# EAGLE design SparkFun_ACS712_Breakout (EAGLE 7.3.0)
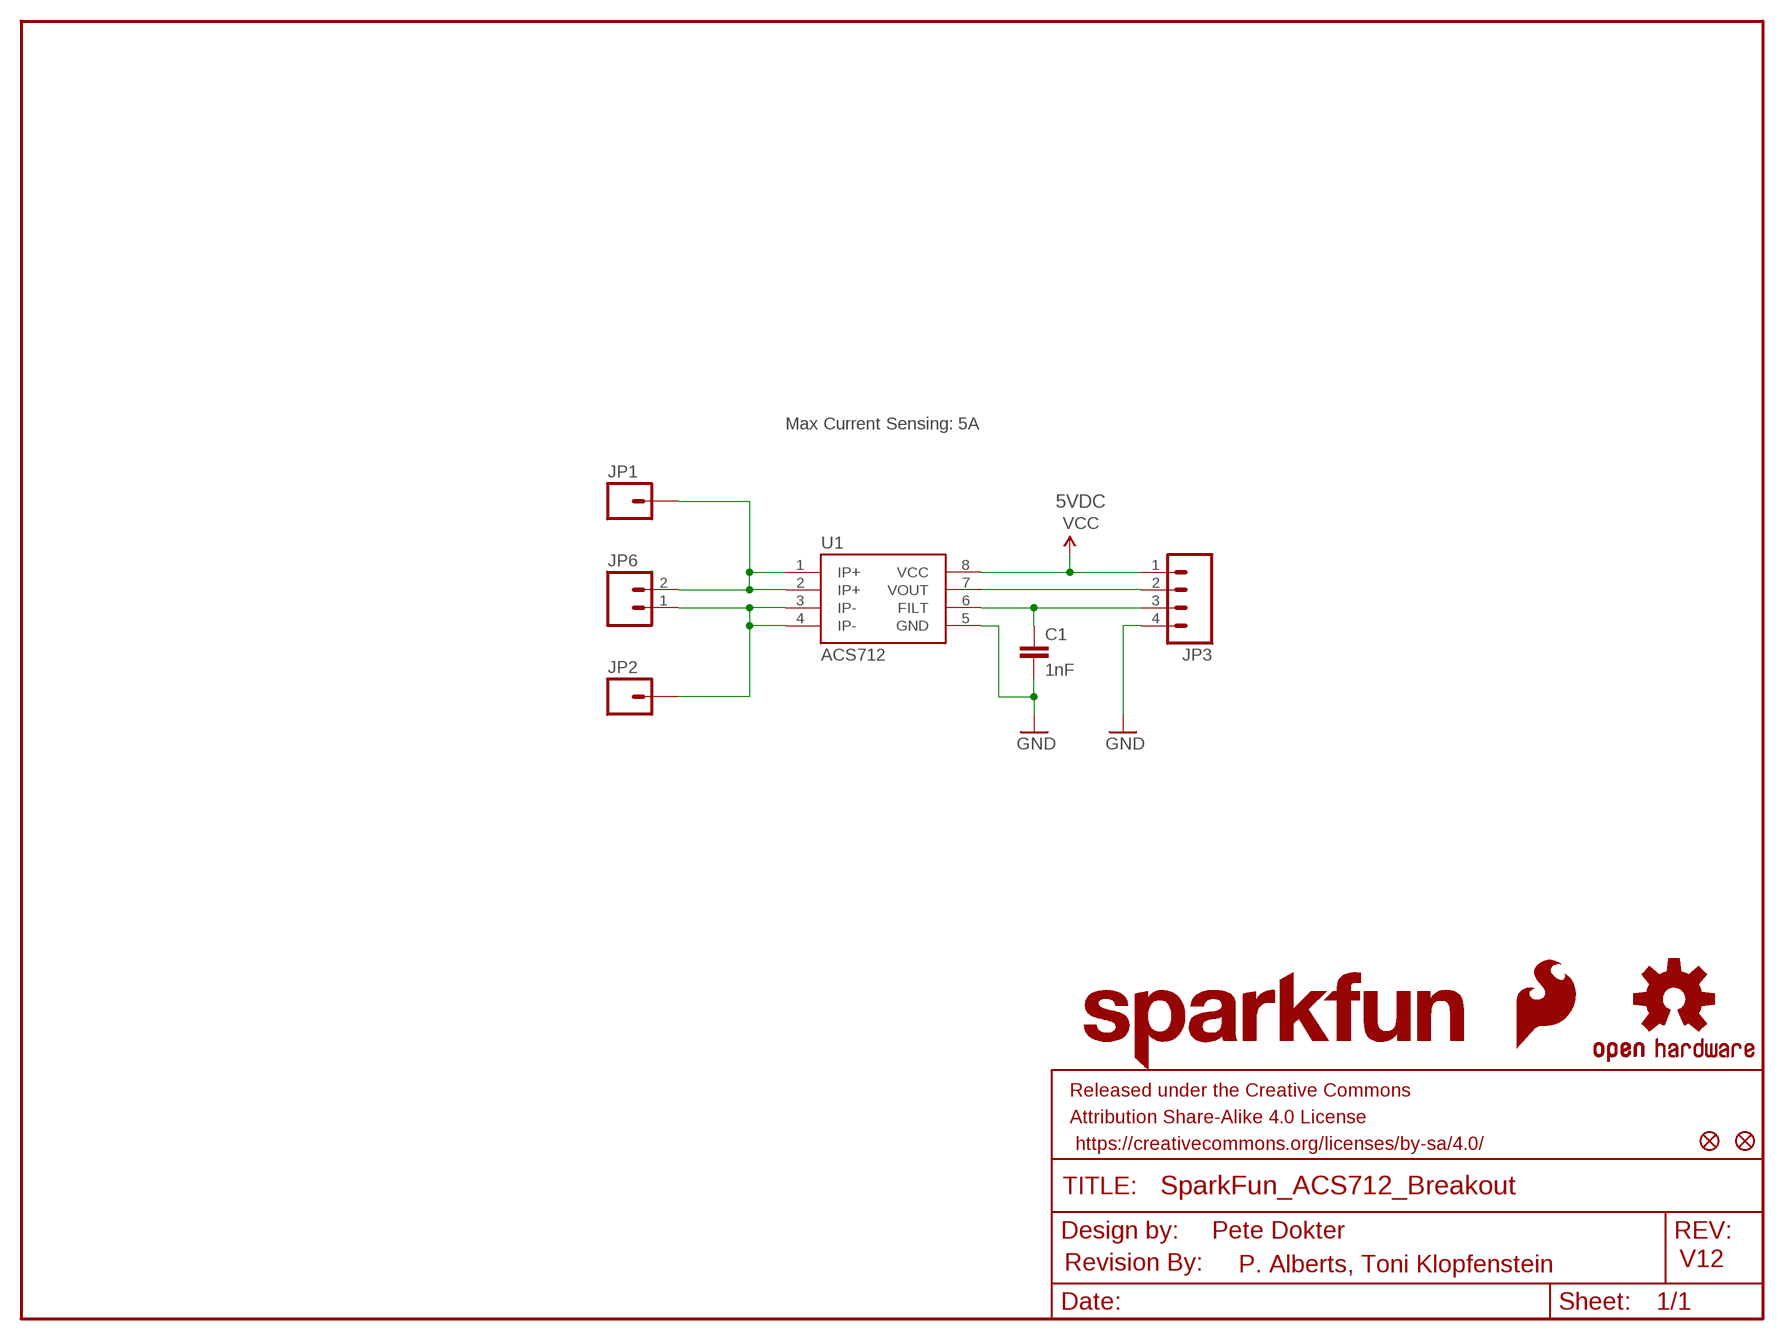
[diagram p0: schematic, sheet 1]

## Parts
C1  1nF  1NF/1000PF-50V-10%(0603)  [0603-CAP]
FRAME1  FRAME-LETTER  [CREATIVE_COMMONS]
JP1  M01-SMTSO-256-ET  [SMTSO-256-ET]
JP2  M01-SMTSO-256-ET  [SMTSO-256-ET]
JP3  M04PTH  [1X04]
JP4  FIDUCIALUFIDUCIAL  [MICRO-FIDUCIAL]
JP5  FIDUCIALUFIDUCIAL  [MICRO-FIDUCIAL]
JP6  M021X02_NO_SILK  [1X02_NO_SILK]
LOGO1  SFE_LOGO_NAME.1_INCH  [SFE_LOGO_NAME_.1]
LOGO2  SFE_LOGO_FLAME.3_INCH  [SFE_LOGO_FLAME_.3]
U1  ACS712  [SO08]
U$1  REVISION  [REVISION]
U$3  OSHW-LOGOS  [OSHW-LOGO-S]

## Nets
FILT: C1.1 JP3.3 U1.6(FILT)
GND: C1.2 JP3.4 U1.5(GND)
IP+: JP1.P$1 JP6.2 U1.1(IP+) U1.2(IP+)
IP-: JP2.P$1 JP6.1 U1.3(IP-) U1.4(IP-)
VCC: JP3.1 U1.8(VCC)
VOUT: JP3.2 U1.7(VOUT)

## Notes on the sheet
- Max Current Sensing: 5A
- 5VDC
- Pete Dokter
- P. Alberts, Toni Klopfenstein | V12

## Library data of the parts
C1 = SparkFun-Capacitors:1NF/1000PF-50V-10%(0603): CAP-07886; PROD_ID: CAP-07886
FRAME1 = SparkFun-Aesthetics:FRAME-LETTER: Schematic Frame Standard 8.5x11 US Letter frame; DESIGNER: NAME; VERSION: v01
JP1 JP2 = SparkFun-Connectors:M01: Header 1 Standard 1-pin 0.1" header. Use with straight break away headers (SKU : PRT-00116), right angle break away headers (PRT-00553), swiss pins (PRT-00743), machine pins (PRT-00117), and female headers (PRT-00115).
JP3 = SparkFun-Connectors:M04: Header 4 Standard 4-pin 0.1" header. Use with straight break away headers (SKU : PRT-00116), right angle break away headers (PRT-00553), swiss pins (PRT-00743), machine pins (PRT-00117), and female headers (PRT-00115). Molex polarized connector foot print use with SKU : PRT-08231 with associated crimp pins and housings. 1MM SMD Version SKU: PRT-10208
JP4 JP5 = SparkFun-Aesthetics:FIDUCIAL: Fiducial Alignment Points Various fiducial points for machine vision alignment.
JP6 = SparkFun-Connectors:M02: Standard 2-pin 0.1" header. Use with - straight break away headers ( PRT-00116) - right angle break away headers (PRT-00553) - swiss pins (PRT-00743) - machine pins (PRT-00117) - female headers (PRT-00115) Molex polarized connector foot print use with: PRT-08233 with associated crimp pins and housings. 2.54_SCREWTERM for use with PRT-10571. 3.5mm Screw Terminal footprints for PRT-08084 5mm Screw Terminal footprints for use with PRT-08432
LOGO1 = SparkFun-Aesthetics:SFE_LOGO_NAME: SFE Logo, name only This is the SparkFun name logo. The logo on the schematic will always be the same size; the package variant is the height of the flame part of the logo (or the height the flame would be, if it were drawn). Default layer for the logo on the board is tSilk.
LOGO2 = SparkFun-Aesthetics:SFE_LOGO_FLAME: SFE Logo, flame only This is the SparkFun flame logo. The logo on the schematic will always be the same size; the package variant is the height of the flame. Default layer for the logo on the board is tSilk.
U1 = SparkFun-AnalogIC:ACS712: Hall-effect-based isolated linear current sensor; PROD_ID: IC-08964
U$1 = SparkFun-Aesthetics:REVISION
U$3 = SparkFun:OSHW-LOGO: Open Source Hardware Logo This logo indicates the piece of hardware it is found on incorporates a OSHW license and/or adheres to the definition of open source hardware found here: http://freedomdefined.org/OSHW

## Board
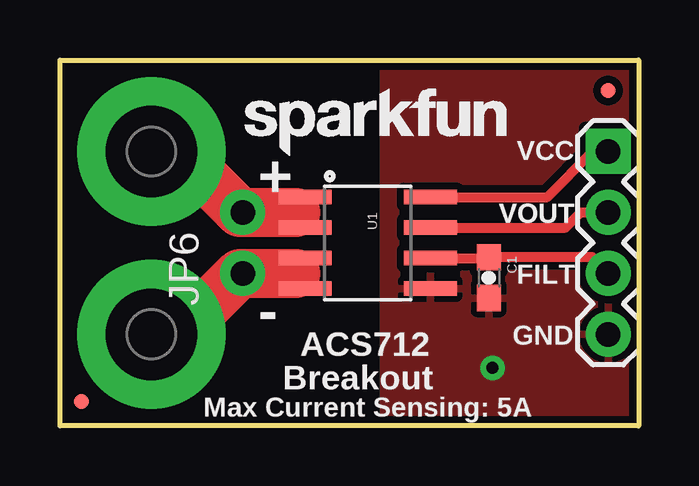
[diagram p1: board, top side]
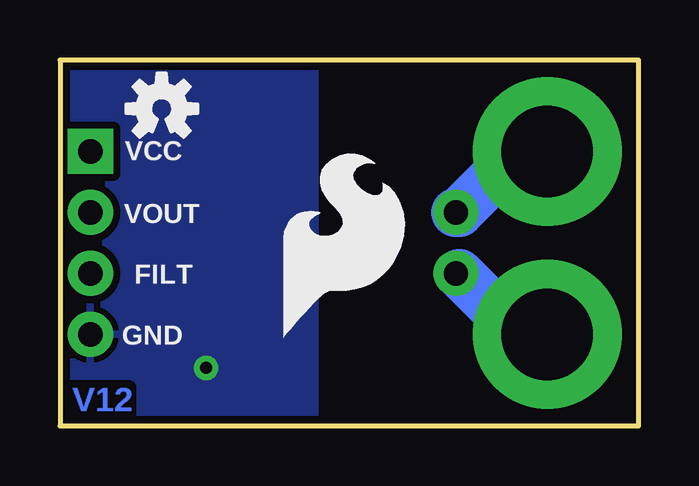
[diagram p2: board, bottom side, seen from below]

Size 24.13 x 15.24 mm. Coordinates in mm from the lower left corner, seen from the top.
Outline: 0,0 0,15.24 24.13,15.24 24.13,0 0,0
Copper layers (1*16): Top 0.035mm / dielectric 1.5mm / Bottom 0.035mm
Design rules "SparkFun-2-layer": minimum track width 7mil, minimum drill 15mil, track to track 8mil, track to pad 8mil, pad to pad 8mil, via to via 8mil, smd to smd 8mil, copper to edge 8mil, drill to drill 8mil, minimum pad ring 12mil, minimum via ring 10mil, stop-mask expansion 4mil, vias tented up to drill 20mil, thermal gap 10mil

### Footprints (pad centres in the part's own frame; a part is rotated, then mirrored left to right if it is on the bottom)
0603-CAP = smd 1.1 x 1: 1 -0.85,0; 2 0.85,0
SMTSO-256-ET = drill 3.81 pad 6.198: P$1 0,0
1X04 = drill 1.016 pad 1.88 square: 1 0,0 | drill 1.016 pad 1.88: 2 2.54,0; 3 5.08,0; 4 7.62,0
MICRO-FIDUCIAL = smd 0.635 x 0.635: 1 0,0
1X02_NO_SILK = drill 1.016 pad 1.88: 1 0,0; 2 2.54,0
SO08 = smd 0.61 x 2.21: 1 -1.905,-2.616; 2 -0.635,-2.616; 3 0.635,-2.616; 4 1.905,-2.616; 5 1.905,2.616; 6 0.635,2.616; 7 -0.635,2.616; 8 -1.905,2.616

### Placement (x,y rotation side)
C1  17.88,6.17 270 top
FRAME1  -20.34,-10.16 0 top  (outside the outline)
JP1  3.81,11.43 0 top
JP2  3.81,3.81 0 top
JP3  22.86,11.43 270 top
JP4  22.86,13.97 0 top
JP5  0.89,1.02 0 top
JP6  7.62,6.35 90 top
LOGO1  7.21,10.74 0 top
LOGO2  15.32,3.56 0 bottom
U1  12.83,7.62 270 top
U$1  -8.89,-12.7 0 top  (outside the outline)
U$3  19.89,13.21 0 bottom

### Tracks (layer width: path | path; a pad name or v marks a point on that pad's centre or on a via)
FILT
  Top 0.254: 17.84,6.99 C1.1
  Top 0.406: JP3.3 22.19,7.02 C1.1 | U1.6 17.84,6.99
GND  (via drill 0.51)
  other vias: 18.03,2.41
  pour Bottom (isolate 0.305): 13.49,0 24.13,0 24.13,15.24 13.49,15.24
  pour Top (isolate 0.305): 13.49,0 24.13,0 24.13,15.24 13.49,15.24
IP+
  Top 0.406: U1.1 10.21,9.26 | U1.2 10.21,8.52
  Top 0.762: 10.21,8.52 9.84,8.89 10.21,9.26
  Top 1.778: 7.49,8.89 JP6.2
  Top 2.032: JP1.P$1 4.95,11.43 7.49,8.89 | JP6.2 9.84,8.89
  Bottom 2.032: JP1.P$1 4.95,11.43 7.49,8.89 JP6.2
IP-
  Top 0.406: U1.3 10.21,6.72 | U1.4 10.21,5.98
  Top 0.762: 10.21,6.72 9.84,6.35 10.21,5.98
  Top 1.778: 7.49,6.35 JP6.1
  Top 2.032: JP2.P$1 4.95,3.81 7.49,6.35 | JP6.1 9.84,6.35
  Bottom 2.032: JP2.P$1 4.95,3.81 7.49,6.35
VCC
  Top 0.406: U1.8 20.32,9.53 22.22,11.43 JP3.1
VOUT
  Top 0.254: U1.7 15.37,8.26
  Top 0.406: JP3.2 21.72,8.89 21.08,8.26 U1.7

### Text on the board
Bottom: V12
tPlace: VCC | + | VOUT | VOUT | FILT | - | GND | ACS712 | Breakout | Max Current Sensing: 5A
bPlace: VCC | VOUT | FILT | GND
tDocu: Pete Dokter | P. Alberts, Toni Klopfenstein